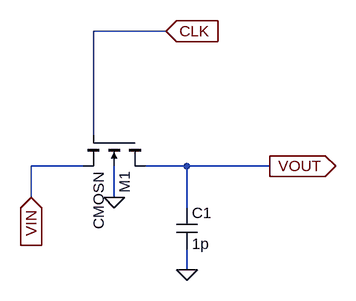
[diagram p0: schematic sH1.asc]
sH1.asc, the LTspice schematic file:
Version 4
SHEET 1 880 680
WIRE 288 -96 176 -96
WIRE 176 64 176 -96
WIRE 160 112 80 112
WIRE 320 112 256 112
WIRE 448 112 320 112
WIRE 80 160 80 112
WIRE 208 160 208 112
WIRE 320 176 320 112
WIRE 320 272 320 240
FLAG 320 272 0
FLAG 208 160 0
FLAG 288 -96 CLK
IOPIN 288 -96 In
FLAG 80 160 VIN
IOPIN 80 160 In
FLAG 448 112 VOUT
IOPIN 448 112 Out
SYMBOL cap 304 176 R0
SYMATTR InstName C1
SYMATTR Value 1p
SYMBOL cmosn 256 64 R90
SYMATTR InstName M1
SYMATTR Value2 l=180n w=2u

The netlist it stands for:
* sH1.asc
C1 VOUT 0 1p
M1 VOUT CLK VIN 0 CMOSN l=180n w=2u
.model NMOS NMOS
.model PMOS PMOS
.lib standard.mos
.backanno
.end